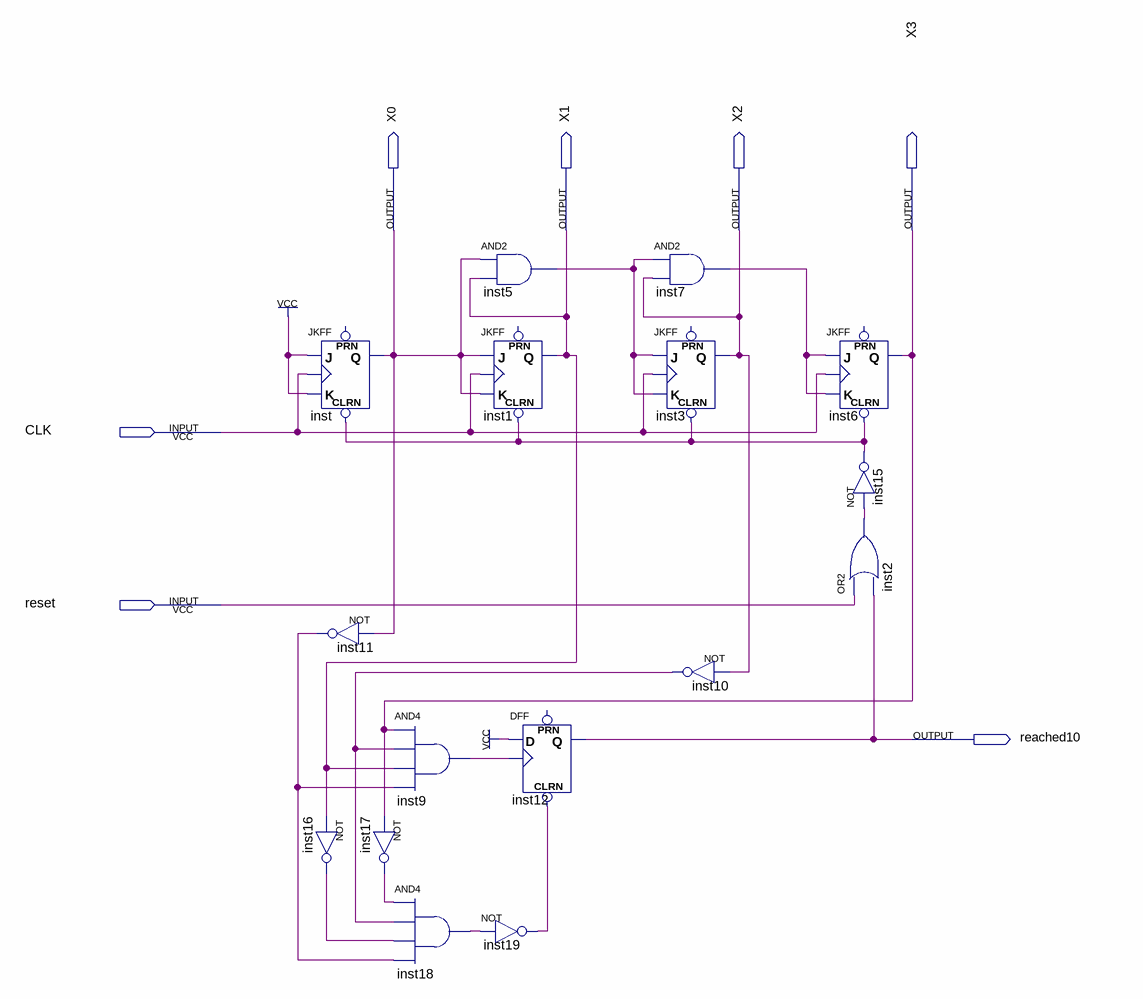
[diagram p0: schematic sheet]
// Quartus schematic 9upsynchronouscounter.bdf as structural Verilog: 16 symbols, 7 pins
module \9upsynchronouscounter  (
  input  CLK,
  input  reset,
  output X0,
  output X1,
  output X2,
  output X3,
  output reached10
);

  wire inst2_out, inst5_out, inst7_out, inst9_out, inst10_out, inst11_out, inst15_out, inst16_out,
       inst17_out, inst18_out, inst19_out;

  JKFF inst (.CLRN(inst15_out), .K(1'b1), .J(1'b1), .CLK(CLK), .Q(X0));  // open: PRN
  not inst11 (inst11_out, X0);
  not inst16 (inst16_out, X1);
  and inst9 (inst9_out, X3, inst10_out, X1, inst11_out);
  not inst17 (inst17_out, X3);
  and inst18 (inst18_out, inst17_out, inst10_out, inst16_out, inst11_out);
  and inst5 (inst5_out, X0, X1);
  JKFF inst1 (.CLRN(inst15_out), .K(X0), .J(X0), .CLK(CLK), .Q(X1));  // open: PRN
  not inst19 (inst19_out, inst18_out);
  DFF inst12 (.CLRN(inst19_out), .CLK(inst9_out), .D(1'b1), .Q(reached10));  // open: PRN
  and inst7 (inst7_out, inst5_out, X2);
  JKFF inst3 (.CLRN(inst15_out), .K(inst5_out), .J(inst5_out), .CLK(CLK), .Q(X2));  // open: PRN
  not inst10 (inst10_out, X2);
  JKFF inst6 (.CLRN(inst15_out), .K(inst7_out), .J(inst7_out), .CLK(CLK), .Q(X3));  // open: PRN
  not inst15 (inst15_out, inst2_out);
  or inst2 (inst2_out, reset, reached10);
endmodule
